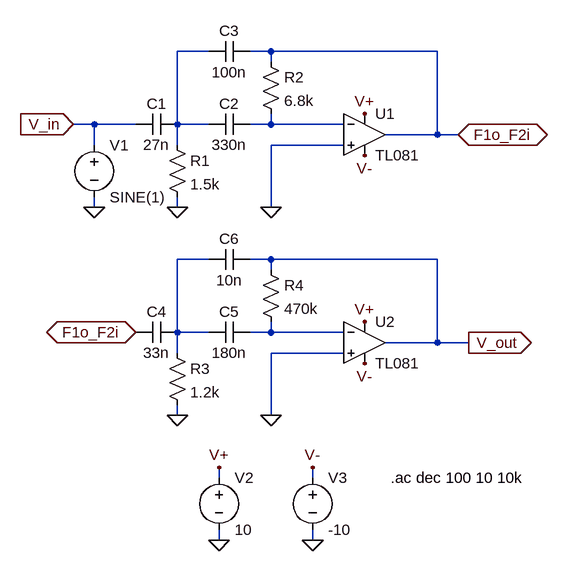
[diagram p0: schematic filter_4th_order_mf_real.asc]
filter_4th_order_mf_real.asc, the LTspice schematic file:
Version 4
SHEET 1 880 992
WIRE 208 192 160 192
WIRE 304 192 272 192
WIRE 560 192 304 192
WIRE 304 208 304 192
WIRE 32 304 0 304
WIRE 96 304 32 304
WIRE 160 304 160 192
WIRE 208 304 160 304
WIRE 304 304 304 288
WIRE 304 304 272 304
WIRE 416 304 304 304
WIRE 560 320 560 192
WIRE 560 320 480 320
WIRE 592 320 560 320
WIRE 32 336 32 304
WIRE 160 336 160 304
WIRE 416 336 304 336
WIRE 32 432 32 416
WIRE 160 432 160 416
WIRE 304 432 304 336
WIRE 208 512 160 512
WIRE 304 512 272 512
WIRE 560 512 304 512
WIRE 304 528 304 512
WIRE 160 624 160 512
WIRE 160 624 144 624
WIRE 208 624 160 624
WIRE 304 624 304 608
WIRE 304 624 272 624
WIRE 416 624 304 624
WIRE 560 640 560 512
WIRE 560 640 480 640
WIRE 608 640 560 640
WIRE 160 656 160 624
WIRE 416 656 304 656
WIRE 160 752 160 736
WIRE 304 752 304 656
WIRE 224 848 224 832
WIRE 368 848 368 832
WIRE 224 944 224 928
WIRE 368 944 368 928
FLAG 0 304 V_in
IOPIN 0 304 In
FLAG 160 432 0
FLAG 304 432 0
FLAG 608 640 V_out
IOPIN 608 640 Out
FLAG 160 752 0
FLAG 304 752 0
FLAG 592 320 F1o_F2i
IOPIN 592 320 BiDir
FLAG 96 624 F1o_F2i
IOPIN 96 624 BiDir
FLAG 32 432 0
FLAG 224 944 0
FLAG 368 944 0
FLAG 448 288 V+
FLAG 448 352 V-
FLAG 448 608 V+
FLAG 448 672 V-
FLAG 224 832 V+
FLAG 368 832 V-
SYMBOL cap 160 288 R90
WINDOW 0 0 32 VBottom 2
WINDOW 3 32 32 VTop 2
SYMATTR InstName C1
SYMATTR Value 27n
SYMBOL res 144 320 R0
SYMATTR InstName R1
SYMATTR Value 1.5k
SYMBOL cap 272 288 R90
WINDOW 0 0 32 VBottom 2
WINDOW 3 32 32 VTop 2
SYMATTR InstName C2
SYMATTR Value 330n
SYMBOL res 288 192 R0
SYMATTR InstName R2
SYMATTR Value 6.8k
SYMBOL cap 272 176 R90
WINDOW 0 0 32 VBottom 2
WINDOW 3 32 32 VTop 2
SYMATTR InstName C3
SYMATTR Value 100n
SYMBOL cap 160 608 R90
WINDOW 0 0 32 VBottom 2
WINDOW 3 32 32 VTop 2
SYMATTR InstName C4
SYMATTR Value 33n
SYMBOL res 144 640 R0
SYMATTR InstName R3
SYMATTR Value 1.2k
SYMBOL cap 272 608 R90
WINDOW 0 0 32 VBottom 2
WINDOW 3 32 32 VTop 2
SYMATTR InstName C5
SYMATTR Value 180n
SYMBOL res 288 512 R0
SYMATTR InstName R4
SYMATTR Value 470k
SYMBOL cap 272 496 R90
WINDOW 0 0 32 VBottom 2
WINDOW 3 32 32 VTop 2
SYMATTR InstName C6
SYMATTR Value 10n
SYMBOL voltage 32 320 R0
SYMATTR InstName V1
SYMATTR Value SINE(1)
SYMATTR Value2 AC 1 0
SYMBOL voltage 224 832 R0
SYMATTR InstName V2
SYMATTR Value 10
SYMBOL voltage 368 832 R0
SYMATTR InstName V3
SYMATTR Value -10
SYMBOL AutoGenerated/TL081 448 320 R0
SYMATTR InstName U1
SYMBOL AutoGenerated/TL081 448 640 R0
SYMATTR InstName U2
TEXT 488 848 Left 2 !.ac dec 100 10 10k

The netlist it stands for:
* filter_4th_order_mf_real.asc
C1 N001 V_in 27n
R1 N001 0 1.5k
C2 N002 N001 330n
R2 F1o_F2i N002 6.8k
C3 F1o_F2i N001 100n
C4 N003 F1o_F2i 33n
R3 N003 0 1.2k
C5 N004 N003 180n
R4 V_out N004 470k
C6 V_out N003 10n
V1 V_in 0 SINE(1) AC 1 0
V2 V+ 0 10
V3 V- 0 -10
* U1: TL081 (symbol AutoGenerated/TL081 not available, pins judged from their places): In+=0 In-=N002 V+=V+ V-=V- OUT=F1o_F2i
* U2: TL081 (symbol AutoGenerated/TL081 not available, pins judged from their places): In+=0 In-=N004 V+=V+ V-=V- OUT=V_out
.ac dec 100 10 10k
.backanno
.end